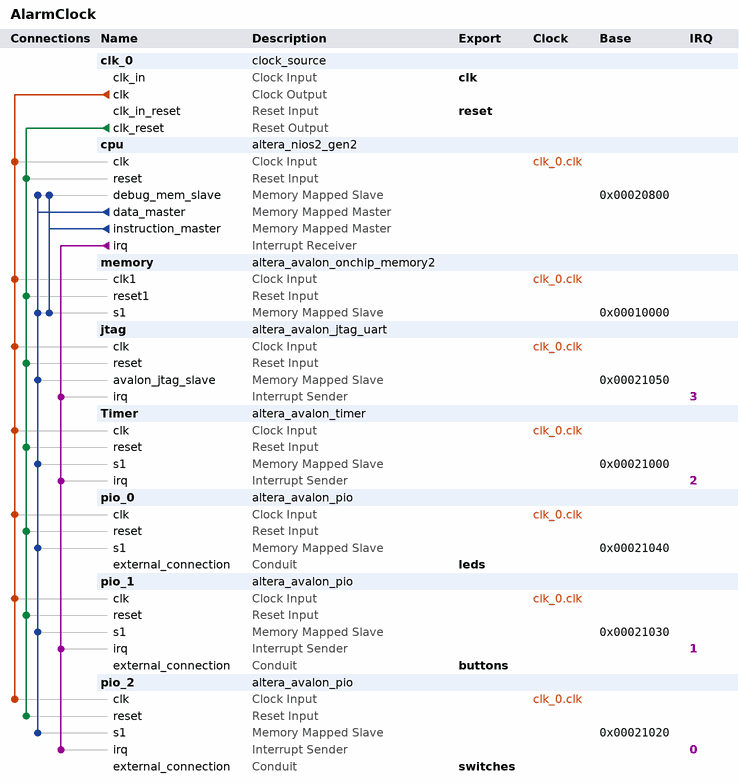
[diagram p0: system contents]
# Platform Designer (Qsys) system AlarmClock, Cyclone V 5CSEMA5F31C6
# Parameters at their usual value, and those the tool derives, are not listed.
package require -exact qsys 18.1
create_system AlarmClock
set_project_property DEVICE_FAMILY {Cyclone V}
set_project_property DEVICE 5CSEMA5F31C6

add_instance clk_0 clock_source 18.1
set_instance_parameter_value clk_0 clockFrequency 50000000

add_instance cpu altera_nios2_gen2 18.1
set_instance_parameter_value cpu dcache_size 2048
set_instance_parameter_value cpu exceptionSlave memory.s1
set_instance_parameter_value cpu icache_size 4096
set_instance_parameter_value cpu impl Tiny
set_instance_parameter_value cpu resetSlave memory.s1

add_instance memory altera_avalon_onchip_memory2 18.1
set_instance_parameter_value memory dataWidth 32
set_instance_parameter_value memory dualPort false
set_instance_parameter_value memory initMemContent true
set_instance_parameter_value memory initializationFileName onchip_mem.hex
set_instance_parameter_value memory memorySize 49060

add_instance jtag altera_avalon_jtag_uart 18.1
set_instance_parameter_value jtag simInteractiveOptions NO_INTERACTIVE_WINDOWS

add_instance Timer altera_avalon_timer 18.1
set_instance_parameter_value Timer period 1
set_instance_parameter_value Timer periodUnits SEC

add_instance pio_0 altera_avalon_pio 18.1
set_instance_parameter_value pio_0 direction Output
set_instance_parameter_value pio_0 width 32

add_instance pio_1 altera_avalon_pio 18.1
set_instance_parameter_value pio_1 captureEdge true
set_instance_parameter_value pio_1 direction Input
set_instance_parameter_value pio_1 edgeType FALLING
set_instance_parameter_value pio_1 generateIRQ true
set_instance_parameter_value pio_1 irqType EDGE
set_instance_parameter_value pio_1 width 4

add_instance pio_2 altera_avalon_pio 18.1
set_instance_parameter_value pio_2 captureEdge true
set_instance_parameter_value pio_2 direction Input
set_instance_parameter_value pio_2 edgeType ANY
set_instance_parameter_value pio_2 generateIRQ true
set_instance_parameter_value pio_2 irqType EDGE
set_instance_parameter_value pio_2 width 4

# connections
add_connection clk_0.clk cpu.clk clock
add_connection clk_0.clk jtag.clk clock
add_connection clk_0.clk memory.clk1 clock
add_connection clk_0.clk pio_0.clk clock
add_connection clk_0.clk pio_1.clk clock
add_connection clk_0.clk pio_2.clk clock
add_connection clk_0.clk Timer.clk clock
add_connection clk_0.clk_reset cpu.reset reset
add_connection clk_0.clk_reset jtag.reset reset
add_connection clk_0.clk_reset memory.reset1 reset
add_connection clk_0.clk_reset pio_0.reset reset
add_connection clk_0.clk_reset pio_1.reset reset
add_connection clk_0.clk_reset pio_2.reset reset
add_connection clk_0.clk_reset Timer.reset reset
add_connection cpu.data_master cpu.debug_mem_slave avalon
set_connection_parameter_value cpu.data_master/cpu.debug_mem_slave baseAddress 0x00020800
add_connection cpu.data_master jtag.avalon_jtag_slave avalon
set_connection_parameter_value cpu.data_master/jtag.avalon_jtag_slave baseAddress 0x00021050
add_connection cpu.data_master memory.s1 avalon
set_connection_parameter_value cpu.data_master/memory.s1 baseAddress 0x00010000
add_connection cpu.data_master pio_0.s1 avalon
set_connection_parameter_value cpu.data_master/pio_0.s1 baseAddress 0x00021040
add_connection cpu.data_master pio_1.s1 avalon
set_connection_parameter_value cpu.data_master/pio_1.s1 baseAddress 0x00021030
add_connection cpu.data_master pio_2.s1 avalon
set_connection_parameter_value cpu.data_master/pio_2.s1 baseAddress 0x00021020
add_connection cpu.data_master Timer.s1 avalon
set_connection_parameter_value cpu.data_master/Timer.s1 baseAddress 0x00021000
add_connection cpu.instruction_master cpu.debug_mem_slave avalon
set_connection_parameter_value cpu.instruction_master/cpu.debug_mem_slave baseAddress 0x00020800
add_connection cpu.instruction_master memory.s1 avalon
set_connection_parameter_value cpu.instruction_master/memory.s1 baseAddress 0x00010000
add_connection cpu.irq jtag.irq interrupt
set_connection_parameter_value cpu.irq/jtag.irq irqNumber 3
add_connection cpu.irq pio_1.irq interrupt
set_connection_parameter_value cpu.irq/pio_1.irq irqNumber 1
add_connection cpu.irq pio_2.irq interrupt
set_connection_parameter_value cpu.irq/pio_2.irq irqNumber 0
add_connection cpu.irq Timer.irq interrupt
set_connection_parameter_value cpu.irq/Timer.irq irqNumber 2

# exported interfaces
add_interface buttons conduit end
set_interface_property buttons EXPORT_OF pio_1.external_connection
add_interface clk clock sink
set_interface_property clk EXPORT_OF clk_0.clk_in
add_interface leds conduit end
set_interface_property leds EXPORT_OF pio_0.external_connection
add_interface reset reset sink
set_interface_property reset EXPORT_OF clk_0.clk_in_reset
add_interface switches conduit end
set_interface_property switches EXPORT_OF pio_2.external_connection

set_interconnect_requirement {$system} qsys_mm.clockCrossingAdapter HANDSHAKE
set_interconnect_requirement {$system} qsys_mm.enableEccProtection FALSE
set_interconnect_requirement {$system} qsys_mm.insertDefaultSlave FALSE
set_interconnect_requirement {$system} qsys_mm.maxAdditionalLatency 1

save_system AlarmClock.qsys
